# EAGLE design MiL-Driver (EAGLE 8.4.1)
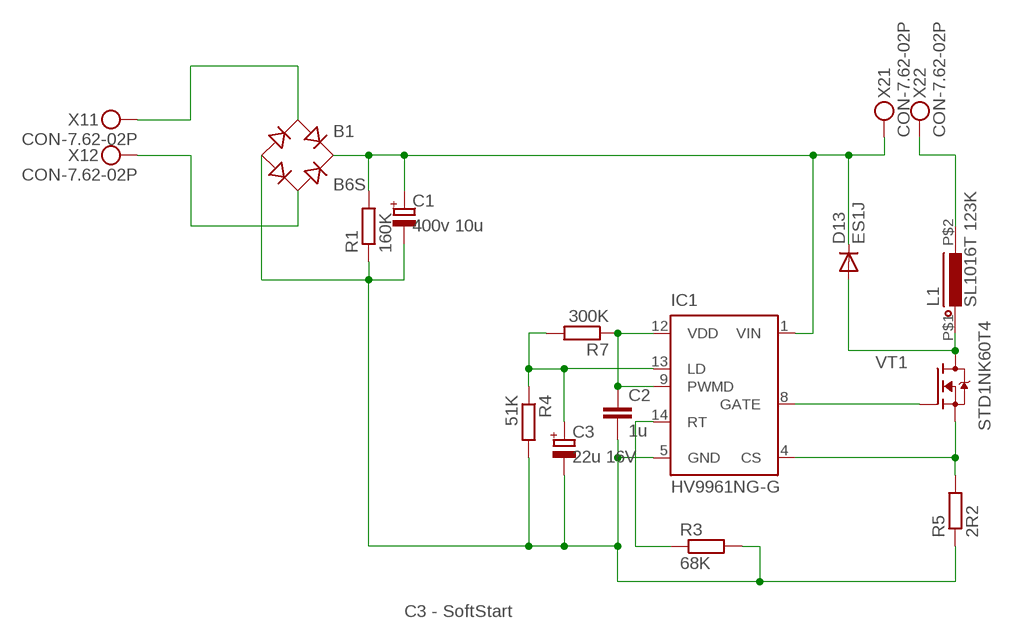
[diagram p0: schematic, sheet 1]

## Parts
B1  B6S  [MBS]
C1  400v 10u  CAP-POL_E3.5-8  [E3,5-8]
C2  1u  CAP_0805  [C0805]
C3  22u 16V  CAP-POL_E2.5-7  [E2,5-7]
D13  ES1J  DIODE_ES1J  [DO214AC]
IC1  HV9961NG-G  HV9910BNG  [SOIC-16NG]
L1  SL1016T 123K  INDUCTORSL1016  [SL1016]
R1  160K  R_MF-0125  [MF-0125]
R3  68K  R_0805  [R0805]
R4  51K  R_0805  [R0805]
R5  2R2  R_MF-025  [MF-025]
R7  300K  R_0805  [R0805]
VT1  STD1NK60T4  FET-NDPAK  [DPAK]
X1  CON-7.62-02P  [KF25C-7.62-02P-13]
X2  CON-7.62-02P  [KF25C-7.62-02P-13]

## Nets
N$3: C2.1 IC1.9(PWMD) IC1.12(VDD) R7.1
N$12: B1.AC1 X1.P$1
N$13: B1.AC2 X1.P$2
N$14: B1.- C1.- C2.2 C3.- IC1.5(GND) R1.1 R3.2 R4.2 R5.1
N$15: C3.+ IC1.13(LD) R4.1 R7.2
N$17: B1.+ C1.+ D13.C IC1.1(VIN) R1.2 X2.P$1
N$19: IC1.4(CS) R5.2 VT1.S
N$20: IC1.14(RT) R3.1
N$21: IC1.8(GATE) VT1.G
N$22: L1.P$2 X2.P$2
N$23: D13.A L1.P$1 VT1.D

## Notes on the sheet
- C3 - SoftStart

## Library data of the parts
B1 = rectifier:B*S: Surface Mount Glass Passivated Bridge Rectifiers Source: Comchip Bridge Rectifiers B05S-G_B10S-G.pdf
C1 C3 = Namenlos:CAP-POL_
C2 = Namenlos:CAP_
D13 = Namenlos:DIODE_
IC1 = Namenlos:HV9910B: Universal High Brightness LED Driver Source: www.supertex.com .. led_driver_ics_SG.pdf; OC_FARNELL: unknown; OC_NEWARK: unknown
L1 = Namenlos:INDUCTOR
R1 R3-R5 R7 = Namenlos:R_
VT1 = Namenlos:FET-N
X1 X2 = Namenlos:CON-7.62-02P

## Board
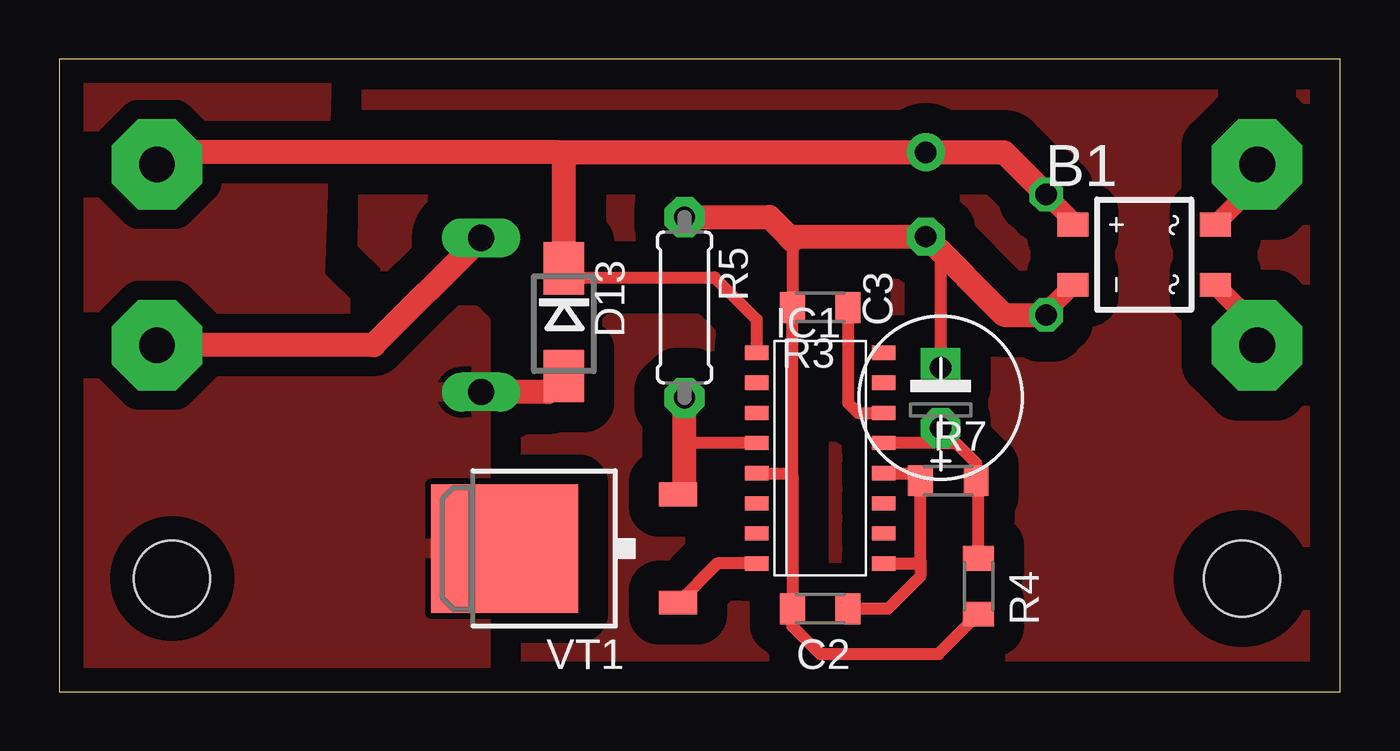
[diagram p1: board, top side]
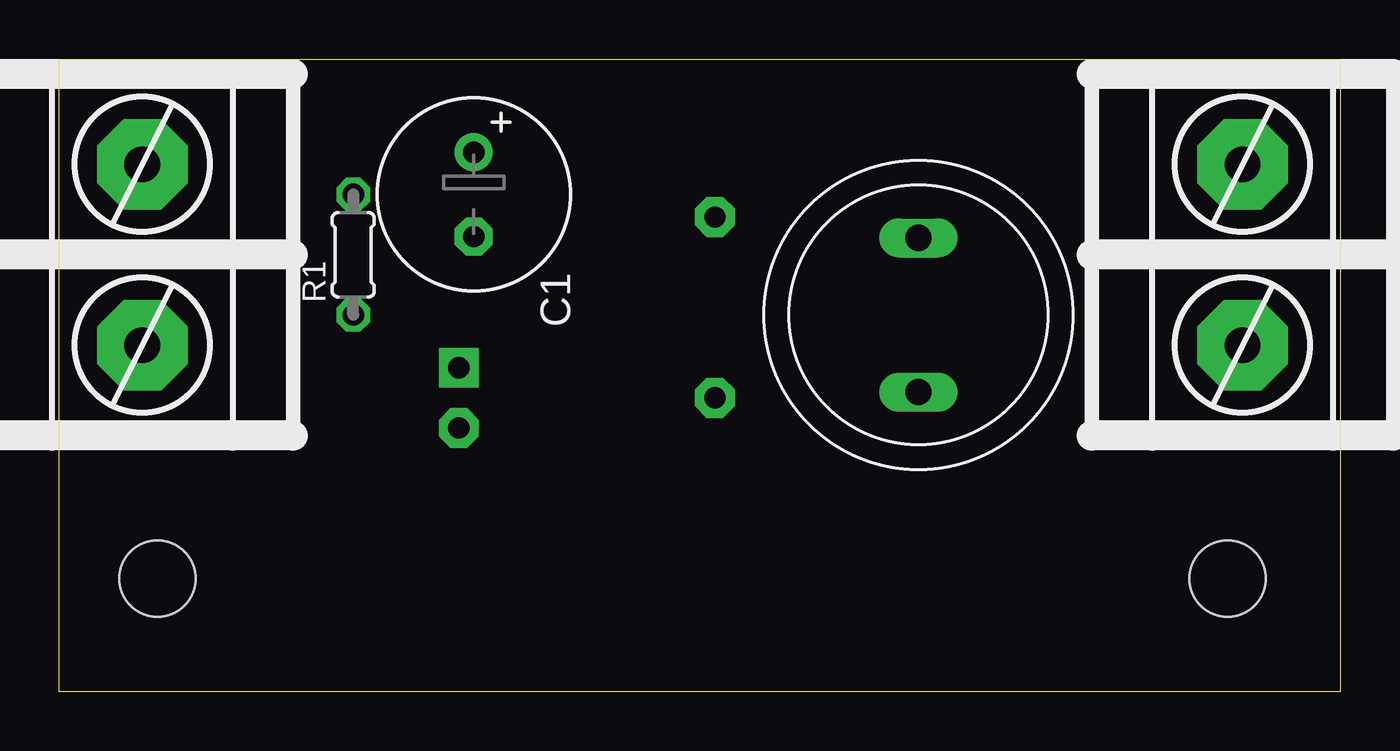
[diagram p2: board, bottom side, seen from below]

Size 53.96 x 26.65 mm. Coordinates in mm from the lower left corner, seen from the top.
Outline: 53.96,0 53.96,26.65 0,26.65 0,0 53.96,0
Copper layers (1*16): Top 0.035mm / dielectric 1.5mm / Bottom 0.035mm
Design rules "default": minimum track width 6mil, minimum drill 0.35mm, track to track 6mil, track to pad 6mil, pad to pad 6mil, via to via 6mil, smd to smd 6mil, copper to edge 40mil, drill to drill 6mil, minimum pad ring 10mil, minimum via ring 8mil, stop-mask expansion 4mil, vias tented up to drill 0mil, thermal gap 10mil
Holes 3.2 mm at 49.83,4.76 4.75,4.76

### Footprints (pad centres in the part's own frame; a part is rotated, then mirrored left to right if it is on the bottom)
MBS = smd 1 x 1.3: + -1.27,-3; - 1.27,-3; AC1 -1.27,3; AC2 1.27,3
E3,5-8 = drill 0.9 pad 1.6: + -1.778,0 | drill 0.9 pad 1.6 octagon: - 1.778,0
C0805 = smd 1.05 x 1.3: 1 -1.175,0; 2 1.175,0
E2,5-7 = drill 0.9 pad 1.676 octagon: + -1.27,0 | drill 0.9 pad 1.676 square: - 1.27,0
DO214AC = smd 2.2 x 1.7: A 2.25,0; C -2.285,0
SOIC-16NG = smd 0.6 x 1: 1 -4.445,-2.675; 2 -3.175,-2.675; 3 -1.905,-2.675; 4 -0.635,-2.675; 5 0.635,-2.675; 6 1.905,-2.675; 7 3.175,-2.675; 8 4.445,-2.675; 9 4.445,2.675; 10 3.175,2.675; 11 1.905,2.675; 12 0.635,2.675; 13 -0.635,2.675; 14 -1.905,2.675; 15 -3.175,2.675; 16 -4.445,2.675
SL1016 = drill 1.1 long: P$1 3.25,0; P$2 -3.25,0
MF-0125 = drill 0.9 octagon: 1 -2.54,0; 2 2.54,0
R0805 = smd 1.05 x 1.3: 1 -1.175,0; 2 1.175,0
MF-025 = drill 0.9 pad 1.676 octagon: 1 -3.81,0; 2 3.81,0
DPAK = smd 5.4 x 6.2: D 0,2.5 | smd 1 x 1.6: G -2.28,-4.8; S 2.28,-4.8
KF25C-7.62-02P-13 = drill 1.5 pad 3.81 octagon: P$1 -3.81,0; P$2 3.81,0

### Placement (x,y rotation side)
B1  45.71,18.41 270 top
C1  36.5,20.95 270 bottom
C2  32.05,3.49 180 top
C3  37.13,12.38 90 top
D13  21.26,15.56 270 top
IC1  32.05,9.84 270 top
L1  17.77,15.88 270 bottom
R1  41.58,18.41 90 bottom
R3  32.05,16.19 180 top
R4  38.72,4.45 270 top
R5  26.34,16.19 270 top
R7  37.45,8.89 0 top
VT1  21.26,6.03 90 top
X1  50.47,18.41 270 bottom
X2  4.12,18.41 270 bottom

### Tracks (layer width: path | path; a pad name or v marks a point on that pad's centre or on a via)
N$1
  pour Top (isolate 1.27, rank 6): -0.01,0 53.96,0 53.96,26.67 -0.01,26.67
N$3
  Top 0.508: IC1.12 35.96,9.21 R7.1 36.28,5.53 | C2.1 34.91,3.49 36.28,4.86 36.28,5.53 | IC1.9 36.15,5.4 36.28,5.53
N$12
  Top 0.813: X1.P$1 50.47,21.45 B1.AC1
N$13
  Top 0.813: X1.P$2 50.47,15.38 B1.AC2
N$14
  Top 0.508: 30.88,9.13 R3.2 30.88,19.03 30.73,19.18 | 30.88,9.13 C2.2 30.88,2.76 32.06,1.59 37.04,1.59 R4.2 | IC1.5 30.8,9.21 30.88,9.13 | C3.- 37.14,18.54 C1.-
  Top 0.813: R1.1 41.58,16.02 B1.-
  Top 1.016: R1.1 39.8,15.88 C1.- 30.73,19.18 | R5.1 29.91,20 30.88,19.03
N$15
  Top 0.508: 37.12,10.48 IC1.13 | 37.12,10.48 37.77,10.48 38.63,9.62 R7.2 38.72,8.79 R4.1 | C3.+ 37.12,11.1 37.12,10.48
N$17
  Top 0.508: 21.64,17.46 27.61,17.46 29.38,15.69 IC1.1
  Top 0.813: 21.64,17.46 D13.C | B1.+ 42.71,19.83 R1.2
  Top 1.016: X2.P$1 4.62,22.73 21.01,22.73 | 21.01,22.73 C1.+ 39.8,22.73 R1.2 | D13.C 21.26,22.49 21.01,22.73
N$19
  Top 0.508: IC1.4 26.42,10.48 26.34,10.55
  Top 1.016: VT1.S 26.34,8.59 26.34,10.55 R5.2
N$20
  Top 0.508: R3.1 33.23,12.16 33.64,11.75 IC1.14
N$21
  Top 0.508: IC1.8 27.71,5.4 VT1.G
N$22
  Top 1.016: L1.P$2 13.25,14.61 X2.P$2
N$23
  Top 1.016: L1.P$1 20.58,12.62 D13.A
  pour Top (isolate 0.813): 17.77,0 17.77,15.56 17.45,15.88 12.37,15.88 10.78,17.46 11.1,26.35 11.74,26.67 0.62,26.67 -0.01,26.04 -0.01,0.64 0.62,0